# Altium schematic sheet Iout.SchDoc
size A4; SheetNumber: 5; SheetTotal: 10
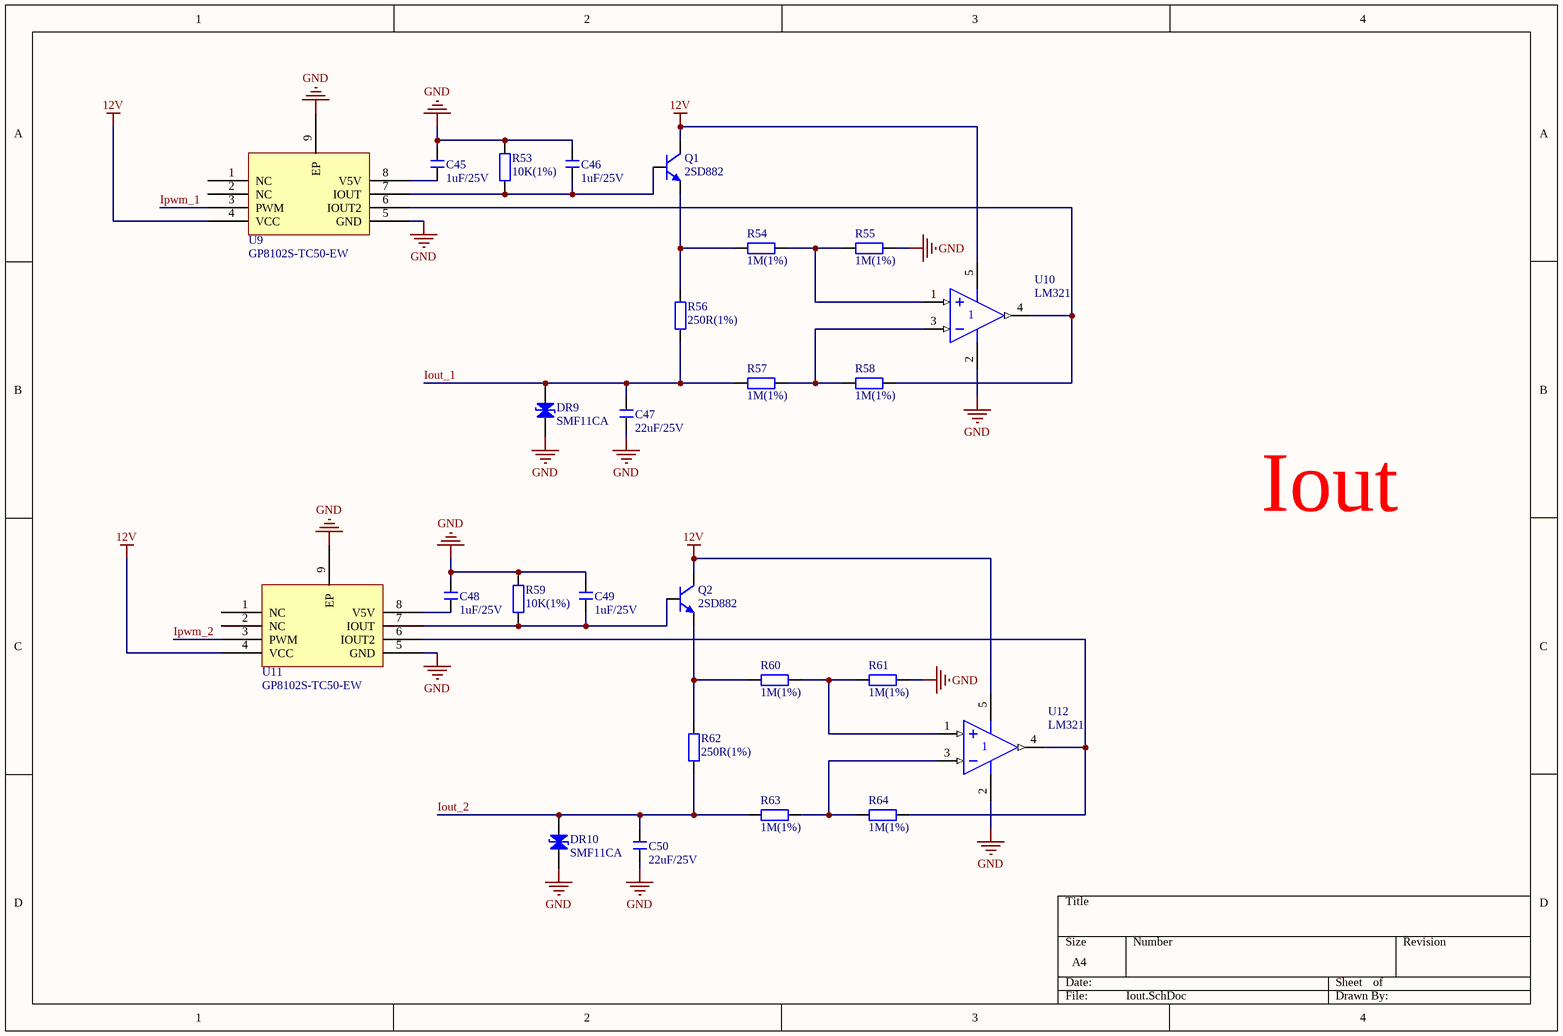
[diagram p0: Iout.SchDoc]

## Parts
C45  1uF/25V  [C 0603_L]
C46  1uF/25V  [C 0603_L]
C47  22uF/25V  [C 0603_L]
C48  1uF/25V  [C 0603_L]
C49  1uF/25V  [C 0603_L]
C50  22uF/25V  [C 0603_L]
DR9  SMF11CA  [SOD-123F]
DR10  SMF11CA  [SOD-123F]
Q1  2SD882  [SOT89_N]
Q2  2SD882  [SOT89_N]
R53  10K(1%)  [R 0603_L]
R54  1M(1%)  [R 0603_L]
R55  1M(1%)  [R 0603_L]
R56  250R(1%)  [R 0603_L]
R57  1M(1%)  [R 0603_L]
R58  1M(1%)  [R 0603_L]
R59  10K(1%)  [R 0603_L]
R60  1M(1%)  [R 0603_L]
R61  1M(1%)  [R 0603_L]
R62  250R(1%)  [R 0603_L]
R63  1M(1%)  [R 0603_L]
R64  1M(1%)  [R 0603_L]
U9  GP8102S-TC50-EW  [ESOP8_N]
U10  LM321  [SOT23-5N]
U11  GP8102S-TC50-EW  [ESOP8_N]
U12  LM321  [SOT23-5N]

## Nets
12V: Q1.2(C) Q2.2(C) U9.4(VCC) U10.5(V+) U11.4(VCC) U12.5(V+)
GND: C45.2 C46.2 C47.2 C48.2 C49.2 C50.2 DR9.2(K) DR10.2(K) R53.2 R55.2 R59.2 R61.2 U9.5(GND) U9.9(EP) U10.2(V-) U11.5(GND) U11.9(EP) U12.2(V-)
Iout_1: C47.1 DR9.1(A) R56.2 R57.1
Iout_2: C50.1 DR10.1(A) R62.2 R63.1
Ipwm_1: U9.3(PWM)
Ipwm_2: U11.3(PWM)
NetC45_1: C45.1 U9.8(V5V)
NetC46_1: C46.1 Q1.1(B) R53.1 U9.7(IOUT)
NetC48_1: C48.1 U11.8(V5V)
NetC49_1: C49.1 Q2.1(B) R59.1 U11.7(IOUT)
NetQ1_3: Q1.3(E) R54.1 R56.1
NetQ2_3: Q2.3(E) R60.1 R62.1
NetR54_2: R54.2 R55.1 U10.1(IN+)
NetR57_2: R57.2 R58.1 U10.3(IN-)
NetR58_2: R58.2 U9.6(IOUT2) U10.4(OUT)
NetR60_2: R60.2 R61.1 U12.1(IN+)
NetR63_2: R63.2 R64.1 U12.3(IN-)
NetR64_2: R64.2 U11.6(IOUT2) U12.4(OUT)

Not connected (* = marked no-connect by the designer): U9 1(NC) 2(NC); U11 1(NC) 2(NC)

## Notes on the sheet
- Iout

## Library data of the parts
C45-C50 = C: 无极性贴片电容; 版权归属: 源创客; BOM名称: 无极性贴片电容; 学习资源: www.ooocke.com
DR9 DR10 = DR: 瞬态电压抑制二极管; 版权归属: 源创客; BOM名称: 瞬态电压抑制二极管; 学习资源: www.ooocke.com
Q1 Q2 = D882-SMD: 音频功放-NPN型; 版权归属: 源创客; 属性: 40V 3A 30W; BOM名称: 音频功放-NPN型; 学习资源: www.ooocke.com
R53-R64 = R: 贴片电阻; 版权归属: 源创客; BOM名称: 贴片电阻; 学习资源: www.ooocke.com